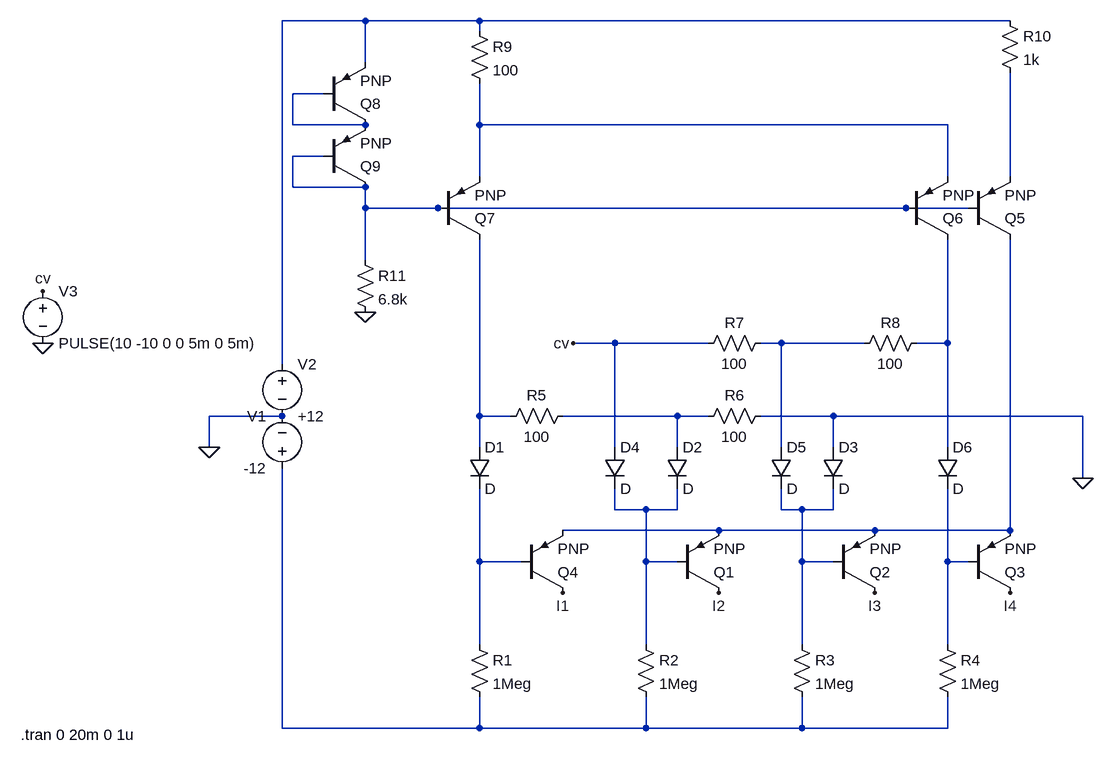
[diagram p0: schematic scanner2.asc]
scanner2.asc, the LTspice schematic file:
Version 4
SHEET 1 880 680
WIRE -448 -688 -576 -688
WIRE -272 -688 -448 -688
WIRE 544 -688 -272 -688
WIRE -272 -672 -272 -688
WIRE -448 -624 -448 -688
WIRE -512 -576 -560 -576
WIRE -560 -528 -560 -576
WIRE -448 -528 -560 -528
WIRE -272 -528 -272 -592
WIRE 448 -528 -272 -528
WIRE -512 -480 -560 -480
WIRE -272 -448 -272 -528
WIRE 448 -448 448 -528
WIRE 544 -448 544 -608
WIRE -560 -432 -560 -480
WIRE -448 -432 -560 -432
WIRE -448 -400 -448 -432
WIRE -336 -400 -448 -400
WIRE 384 -400 -336 -400
WIRE 480 -400 384 -400
WIRE -448 -320 -448 -400
WIRE -64 -192 -128 -192
WIRE 80 -192 -64 -192
WIRE 192 -192 160 -192
WIRE 320 -192 192 -192
WIRE 448 -192 448 -352
WIRE 448 -192 400 -192
WIRE -576 -160 -576 -688
WIRE -576 -80 -688 -80
WIRE -272 -80 -272 -352
WIRE -224 -80 -272 -80
WIRE 32 -80 -144 -80
WIRE 80 -80 32 -80
WIRE 272 -80 160 -80
WIRE 656 -80 272 -80
WIRE -688 -32 -688 -80
WIRE -272 -32 -272 -80
WIRE -64 -32 -64 -192
WIRE 32 -32 32 -80
WIRE 192 -32 192 -192
WIRE 272 -32 272 -80
WIRE 448 -32 448 -192
WIRE 656 16 656 -80
WIRE -64 64 -64 32
WIRE -16 64 -64 64
WIRE 32 64 32 32
WIRE 32 64 -16 64
WIRE 192 64 192 32
WIRE 224 64 192 64
WIRE 272 64 272 32
WIRE 272 64 224 64
WIRE 96 96 -144 96
WIRE 336 96 96 96
WIRE 544 96 544 -352
WIRE 544 96 336 96
WIRE -272 144 -272 32
WIRE -208 144 -272 144
WIRE -16 144 -16 64
WIRE 32 144 -16 144
WIRE 224 144 224 64
WIRE 272 144 224 144
WIRE 448 144 448 32
WIRE 480 144 448 144
WIRE -272 272 -272 144
WIRE -16 272 -16 144
WIRE 224 272 224 144
WIRE 448 272 448 144
WIRE -576 400 -576 0
WIRE -272 400 -272 352
WIRE -272 400 -576 400
WIRE -16 400 -16 352
WIRE -16 400 -272 400
WIRE 224 400 224 352
WIRE 224 400 -16 400
WIRE 448 400 448 352
WIRE 448 400 224 400
FLAG 656 16 0
FLAG -128 -192 cv
FLAG -144 192 I1
FLAG 96 192 I2
FLAG 336 192 I3
FLAG 544 192 I4
FLAG -448 -240 0
FLAG -688 -32 0
FLAG -944 -272 cv
FLAG -944 -192 0
SYMBOL pnp 32 192 M180
SYMATTR InstName Q1
SYMBOL pnp 272 192 M180
SYMATTR InstName Q2
SYMBOL pnp 480 192 M180
SYMATTR InstName Q3
SYMBOL pnp -208 192 M180
SYMATTR InstName Q4
SYMBOL diode -288 -32 R0
SYMATTR InstName D1
SYMBOL diode 16 -32 R0
SYMATTR InstName D2
SYMBOL diode 256 -32 R0
SYMATTR InstName D3
SYMBOL diode -80 -32 R0
SYMATTR InstName D4
SYMBOL res -288 256 R0
SYMATTR InstName R1
SYMATTR Value 1Meg
SYMBOL res -32 256 R0
SYMATTR InstName R2
SYMATTR Value 1Meg
SYMBOL res 208 256 R0
SYMATTR InstName R3
SYMATTR Value 1Meg
SYMBOL res 432 256 R0
SYMATTR InstName R4
SYMATTR Value 1Meg
SYMBOL diode 176 -32 R0
SYMATTR InstName D5
SYMBOL res -128 -96 R90
WINDOW 0 0 56 VBottom 2
WINDOW 3 32 56 VTop 2
SYMATTR InstName R5
SYMATTR Value 100
SYMBOL res 176 -96 R90
WINDOW 0 0 56 VBottom 2
WINDOW 3 32 56 VTop 2
SYMATTR InstName R6
SYMATTR Value 100
SYMBOL diode 432 -32 R0
SYMATTR InstName D6
SYMBOL res 176 -208 R90
WINDOW 0 0 56 VBottom 2
WINDOW 3 32 56 VTop 2
SYMATTR InstName R7
SYMATTR Value 100
SYMBOL res 416 -208 R90
WINDOW 0 0 56 VBottom 2
WINDOW 3 32 56 VTop 2
SYMATTR InstName R8
SYMATTR Value 100
SYMBOL pnp 480 -352 M180
SYMATTR InstName Q5
SYMBOL pnp 384 -352 M180
SYMATTR InstName Q6
SYMBOL pnp -336 -352 M180
SYMATTR InstName Q7
SYMBOL res -288 -688 R0
SYMATTR InstName R9
SYMATTR Value 100
SYMBOL res 528 -704 R0
SYMATTR InstName R10
SYMATTR Value 1k
SYMBOL voltage -576 -176 R0
WINDOW 123 0 0 Left 0
WINDOW 39 0 0 Left 0
SYMATTR InstName V2
SYMATTR Value +12
SYMBOL pnp -512 -528 M180
SYMATTR InstName Q8
SYMBOL pnp -512 -432 M180
SYMATTR InstName Q9
SYMBOL res -464 -336 R0
SYMATTR InstName R11
SYMATTR Value 6.8k
SYMBOL voltage -576 16 R180
WINDOW 0 24 96 Left 2
WINDOW 3 24 16 Left 2
WINDOW 123 0 0 Left 0
WINDOW 39 0 0 Left 0
SYMATTR InstName V1
SYMATTR Value -12
SYMBOL voltage -944 -288 R0
WINDOW 123 0 0 Left 0
WINDOW 39 0 0 Left 0
SYMATTR InstName V3
SYMATTR Value PULSE(10 -10 0 0 5m 0 5m)
TEXT -978 410 Left 2 !.tran 0 20m 0 1u

The netlist it stands for:
* scanner2.asc
Q1 I2 N010 N012 0 PNP
Q2 I3 N011 N012 0 PNP
Q3 I4 N014 N012 0 PNP
Q4 I1 N013 N012 0 PNP
D1 N008 N013 D
D2 N009 N010 D
D3 0 N011 D
D4 cv N010 D
R1 N013 N015 1Meg
R2 N010 N015 1Meg
R3 N011 N015 1Meg
R4 N014 N015 1Meg
D5 N006 N011 D
R5 N009 N008 100
R6 0 N009 100
D6 N007 N014 D
R7 N006 cv 100
R8 N007 N006 100
Q5 N012 N004 N005 0 PNP
Q6 N007 N004 N003 0 PNP
Q7 N008 N004 N003 0 PNP
R9 N001 N003 100
R10 N001 N005 1k
V2 N001 0 +12
Q8 N002 N002 N001 0 PNP
Q9 N004 N004 N002 0 PNP
R11 N004 0 6.8k
V1 N015 0 -12
V3 cv 0 PULSE(10 -10 0 0 5m 0 5m)
.model D D
.lib standard.dio
.model NPN NPN
.model PNP PNP
.lib standard.bjt
.tran 0 20m 0 1u
.backanno
.end